# Altium schematic sheet Navigator_1.SchDoc
size A
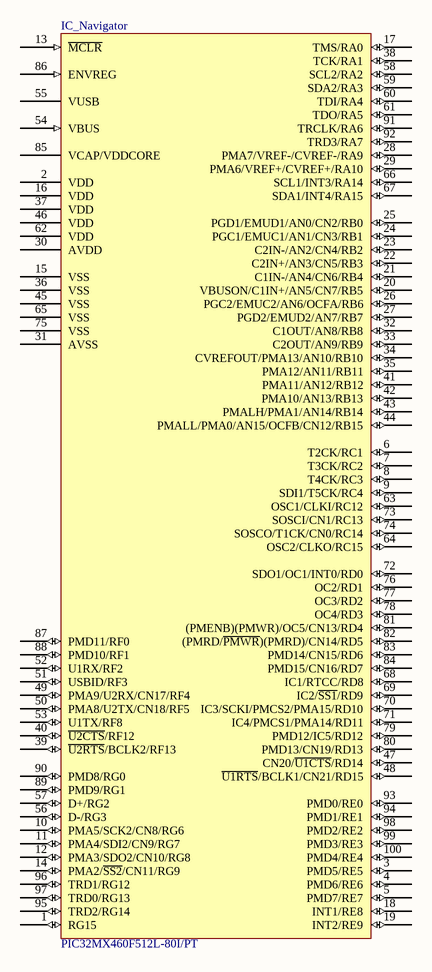
[diagram p0: Navigator_1.SchDoc]

## Parts
IC_Navigator  PIC32MX460F512L-80I/PT  [TQFP-PT100_N]

## Nets

Not connected (* = marked no-connect by the designer): IC_Navigator 1(RG15) 2(VDD) 3(PMD5/RE5) 4(PMD6/RE6) 5(PMD7/RE7) 6(T2CK/RC1) 7(T3CK/RC2) 8(T4CK/RC3) 9(SDI1/T5CK/RC4) 10(PMA5/SCK2/CN8/RG6) 11(PMA4/SDI2/CN9/RG7) 12(PMA3/SDO2/CN10/RG8) 13(~{MCLR}) 14(PMA2/~{SS2}/CN11/RG9) 15(VSS) 16(VDD) 17(TMS/RA0) 18(INT1/RE8) 19(INT2/RE9) 20(VBUSON/C1IN+/AN5/CN7/RB5) 21(C1IN-/AN4/CN6/RB4) 22(C2IN+/AN3/CN5/RB3) 23(C2IN-/AN2/CN4/RB2) 24(PGC1/EMUC1/AN1/CN3/RB1) 25(PGD1/EMUD1/AN0/CN2/RB0) 26(PGC2/EMUC2/AN6/OCFA/RB6) 27(PGD2/EMUD2/AN7/RB7) 28(PMA7/VREF-/CVREF-/RA9) 29(PMA6/VREF+/CVREF+/RA10) 30(AVDD) 31(AVSS) 32(C1OUT/AN8/RB8) 33(C2OUT/AN9/RB9) 34(CVREFOUT/PMA13/AN10/RB10) 35(PMA12/AN11/RB11) 36(VSS) 37(VDD) 38(TCK/RA1) 39(~{U2RTS}/BCLK2/RF13) 40(~{U2CTS}/RF12) 41(PMA11/AN12/RB12) 42(PMA10/AN13/RB13) 43(PMALH/PMA1/AN14/RB14) 44(PMALL/PMA0/AN15/OCFB/CN12/RB15) 45(VSS) 46(VDD) 47(CN20/~{U1CTS}/RD14) 48(~{U1RTS}/BCLK1/CN21/RD15) 49(PMA9/U2RX/CN17/RF4) 50(PMA8/U2TX/CN18/RF5) 51(USBID/RF3) 52(U1RX/RF2) 53(U1TX/RF8) 54(VBUS) 55(VUSB) 56(D-/RG3) 57(D+/RG2) 58(SCL2/RA2) 59(SDA2/RA3) 60(TDI/RA4) 61(TDO/RA5) 62(VDD) 63(OSC1/CLKI/RC12) 64(OSC2/CLKO/RC15) 65(VSS) 66(SCL1/INT3/RA14) 67(SDA1/INT4/RA15) 68(IC1/RTCC/RD8) 69(IC2/~{SS1}/RD9) 70(IC3/SCKI/PMCS2/PMA15/RD10) 71(IC4/PMCS1/PMA14/RD11) 72(SDO1/OC1/INT0/RD0) 73(SOSCI/CN1/RC13) 74(SOSCO/T1CK/CN0/RC14) 75(VSS) 76(OC2/RD1) 77(OC3/RD2) 78(OC4/RD3) 79(PMD12/IC5/RD12) 80(PMD13/CN19/RD13) 81((PMENB)(PMWR)/OC5/CN13/RD4) 82((PMRD/~{PMWR})(PMRD)/CN14/RD5) 83(PMD14/CN15/RD6) 84(PMD15/CN16/RD7) 85(VCAP/VDDCORE) 86(ENVREG) 87(PMD11/RF0) 88(PMD10/RF1) 89(PMD9/RG1) 90(PMD8/RG0) 91(TRCLK/RA6) 92(TRD3/RA7) 93(PMD0/RE0) 94(PMD1/RE1) 95(TRD2/RG14) 96(TRD1/RG12) 97(TRD0/RG13) 98(PMD2/RE2) 99(PMD3/RE3) 100(PMD4/RE4)

## Library data of the parts
IC_Navigator = PIC32MX460F512L-80I/PT: 32-Bit Flash Microcontroller with USB, 85 IOs, 512KB Program Memory, 100-pin TQFP; Published: 29-Jan-2009; DatasheetVersion: revC, Apr-2008; PackageVersion: revAW, Oct-2008; PackageReference: TQFP-PT100; Publisher: Altium Limited; PackageDescription: 100-Lead Plastic Thin Quad Flatpack (PT) - 12x12x1mm Body, 2.00mm [TQFP]; ComponentLink1Description: Manufacturer Link; ComponentLink1URL: http://www.microchip.com; ComponentLink2Description: Datasheet; ComponentLink2URL: http://ww1.microchip.com/downloads/en/DeviceDoc/PIC32MX_Datasheet_v3_61143C.pdf; ComponentLink3Description: Packaging Specification; ComponentLink3URL: http://ww1.microchip.com/downloads/en/PackagingSpec/00049AW.pdf